# Altium schematic sheet PowerModuleCell.SchDoc
size A4; SheetNumber: 1; SheetTotal: 10
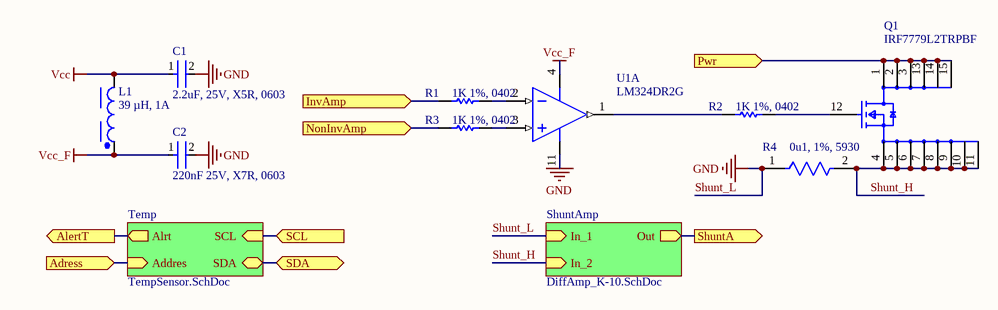
[diagram p0: PowerModuleCell.SchDoc]

## Parts
C1  2.2uF, 25V, X5R, 0603  [FP-GRM188-0_1-e0_2_0_5-MFG]
C2  220nF 25V, X7R, 0603  [FP-GCM188-0_1-IPC_B]
L1  39 µH, 1A  [WE-PD_7345]
Q1  IRF7779L2TRPBF  [FP-MG-WDSON-11-MFG]
R1  1K 1%, 0402  [RESC1005X40X25NL05T05]
R2  1K 1%, 0402  [RESC1005X40X25NL05T05]
R3  1K 1%, 0402  [RESC1005X40X25NL05T05]
R4  0u1, 1%, 5930  [FP-CSS2H-5930K-1L00F-MFG]
U1  LM324DR2G  [ONSC-SOIC-14-751A-03_V]  (part A of 4)

## Sub-sheets
ShuntAmp = DiffAmp_K-10.SchDoc: Out (out), In_2 (in), In_1 (in)
Temp = TempSensor.SchDoc: Alrt (out), SDA (bidir), SCL (in), Addres (in)

## Ports
Adress (in), AlertT (out), InvAmp (in, see PowerModule[3A]), NonInvAmp (in, see PowerModule[3A]), Pwr (in, see PowerModule[3A]), SCL (in, see PowerModule[4A], TempSensor[2A]), SDA (bidir, see PowerModule[4A], TempSensor[2A]), ShuntA (out, see PowerModule[3A])

## Nets
Shunt_L: C1.2 C2.2 R4.1 U1.11(VEE/GND) ; sheet ShuntAmp/In_1  [also labelled GND]
Vcc: C1.1 L1.2
Vcc_F: C2.1 L1.1 U1.4(VCC)
Adress: port Adress, sheet Temp/Addres
AlertT: port AlertT, sheet Temp/Alrt
InvAmp: R1.1 ; port InvAmp
NonInvAmp: R3.1 ; port NonInvAmp
Pwr: Q1.1(Drain) Q1.2(Drain) Q1.3(Drain) Q1.13(Drain) Q1.14(Drain) Q1.15(Drain) ; port Pwr
SCL: port SCL, sheet Temp/SCL
SDA: port SDA, sheet Temp/SDA
Shunt_H: Q1.4(Source) Q1.5(Source) Q1.6(Source) Q1.7(Source) Q1.8(Source) Q1.9(Source) Q1.10(Source) Q1.11(Source) R4.2 ; sheet ShuntAmp/In_2
ShuntA: port ShuntA, sheet ShuntAmp/Out
NetQ1_12: Q1.12(Gate) R2.2
NetR1_2: R1.2 U1.2(IN1-)
NetR2_1: R2.1 U1.1(OUT1)
NetR3_2: R3.2 U1.3(IN1+)

## Library data of the parts
C1 = CMP-2006-02820-2: Chip Multilayer Ceramic Capacitors for General Purpose, 0603, 2.2uF, X5R, 15%, 10%, 25V; Number of Pins: 2; Dielectric: X5R; Tolerance: 10%; Case Code (Imperial): 0603; Thickness: 0.035inch; Case/Package: 0603; Lead Free: Lead Free; Mount: Surface Mount; Material: Ceramic; Depth: 0.8mm; Voltage: 25V; Capacitance: 2.2uF; Min Operating Temperature: -55°C; Package Quantity: 4000; REACH SVHC: No SVHC; Resistor Type: Ceramic; Packaging: Tape and Reel; Case Code (Metric): 1608; Max Operating Temperature: 85°C; Width: 0.8mm; Termination: SMD/SMT; Voltage Rating: 25V; Length: 1.6mm; Voltage Rating (DC): 25V; Height: 0.8mm; Radiation Hardening: No; Weight: 0.000222oz
C2 = CMP-2006-02366-2: Ceramic Capacitor for Automotive 220nF  ±10% 25VDC X7R 0603 Paper T/R; Capacitance: 220nF; Mount: Surface Mount; Ratings: AEC-Q200; Case/Package: 0603; Packaging: Tape and Reel; Radiation Hardening: No; Voltage: 25V; Dielectric: X7R; Case Code (Imperial): 0603; Max Operating Temperature: 125°C; Min Operating Temperature: -55°C; Depth: 0.8mm; Termination: SMD/SMT; Package Quantity: 1; Case Code (Metric): 1608; Thickness: 0.035inch; Voltage Rating: 25V; Tolerance: 10%; Voltage Rating (DC): 25V; Height: 0.8mm; Lead Free: Lead Free; Length: 1.6mm; Width: 0.031inch
L1 = CMP-0227-00153-2: NexarPartId: 29930417; Max DC Current: 1.11A; Shielding: Shielded; Inductance: 39µH; Self Resonant Frequency: 11MHz; DC Resistance (DCR): 145mΩ; Tolerance: 20%; Ambient Temperature Range Low: -40°C; Width: 7.3mm; Length: 7.3mm; Number of Pins: 2; Packaging: Tape & Reel; Height: 4.5mm; Ambient Temperature Range High: 85°C; Max Operating Temperature: 125°C; Depth: 7.3mm; Min Operating Temperature: -40°C; RoHS: Compliant; Current Rating: 1.11A
Q1 = CMP-32901-000937-1: MOSFET N-CH 150V 375A DIRECTFET; Drain to Source Resistance: 11mR; Power Dissipation: 125W; Turn-On Delay Time: 16ns; Threshold Voltage: 4V; Input Capacitance: 6.66nF; Turn-Off Delay Time: 36ns; Gate to Source Voltage (Vgs): 20V; Length: 0.36inch; Number of Pins: 11; Min Operating Temperature: -55°C; Halogen Free: Halogen Free; Rds On Max: 11mR; REACH SVHC: No SVHC; Max Operating Temperature: 175°C; Continuous Drain Current (ID): 375A; Max Power Dissipation: 125W; Mount: Surface Mount; Width: 0.28inch; Max Dual Supply Voltage: 150V; Lead Free: Lead Free; Height: 0.02inch; Series: HEXFET®; RoHS Compliant: Yes; Drain to Source Voltage (Vdss): 150V; Packaging: Cut Tape
R1-R3 = CMP-1011-00510-4: Chip Resistor, 1 KOhm, +/- 1%, 100 mW, -55 to 155 degC, 0402 (1005 Metric), RoHS, Tape and Reel; PartNumber: ERJ-2RKF1001X; Manufacturer: Basic Passives; Voltage Rating: 50 V; Case\/Package: 0402; Resistance: 1 KOhm; Power Rating: 100 mW; DatasheetVersion: 04/2015; Radiation Hardening: No; Pins: 2; Height: 0.35 mm; RoHSCompliant: true; Case Code (Imperial): 0402; ComponentLink2Description: Datasheet; ComponentLink1Description: Manufacturer URL; PackageReference: 0402; Mount: Surface Mount; Package Quantity: 10000; Tolerance: 1%; ComponentLink1URL: http://www.panasonic.com/; PackageDescription: 2-Pin Surface Mount Device, Body 1 x 0.5 mm; Mounting Technology: Surface Mount; Case Code (Metric): 1005; ComponentLink2URL: http://industrial.panasonic.com/cdbs/www-data/pdf/RDA0000/AOA0000C86.pdf; REACH SVHC: Yes; Packaging: Tape and Reel; Max Operating Temperature: 155 degC; Min Operating Temperature: -55 degC; Width: 0.5 mm; Length: 1 mm
R4 = CMP-00059-73869598-1: CSS2H-5930K-1L00F Res Metal Strip 5930 0.001 Ohm 1% 9W ±50ppm/C Pad SMD Automotive T/R; Resistance: 1mΩ; Temperature Coefficient: 50ppm/°C; Case Code (Imperial): 5931; Width: 7.747mm; Min Operating Temperature: -55°C; Tolerance: 1%; Max Power Dissipation: 9W; Case Code (Metric): 1577; Max Operating Temperature: 170°C; NexarPartId: 73869598; Power Rating: 9W; Composition: Metal Element; Case/Package: 5930; Height: 939.8µm; Number of Terminations: 2; Schedule B: 8533210045, 8533210045; Packaging: Cut Tape; REACH SVHC: No SVHC; Features: Moisture Resistant; RoHS: Compliant; Length: 15.0114mm
U1 = CMP-1310-00171-1: Single Supply Quad Operational Amplifier, 3 to 32 V, 0 to 70 degC, 14-Pin SOIC, Pb-Free, Tape and Reel; Manufacturer: On Semiconductor; VCC Max (V): 32; VCC Min (V): 3; PackageVersion: Rev. K, 05/2011; ComponentLink3URL: http://www.onsemi.com/pub_link/Collateral/751A-03.PDF; ComponentLink3Description: Package Specification; Packing: Tape and Reel; ComponentLink2URL: http://www.onsemi.cn/pub_link/Collateral/LM324-D.PDF; PackageReference: SOIC-14-751A-03; ComponentLink1URL: http://www.onsemi.com/; PackageDescription: 14-Pin Small Outline Integrated Circuit, Body 8.65 x 3.9 mm, Pitch 1.27 mm; ComponentLink1Description: Manufacturer URL; DatasheetVersion: Rev. 25; Mounting Technology: Surface Mount; RoHS: TRUE; ComponentLink2Description: Datasheet; PartNumber: LM324DR2G